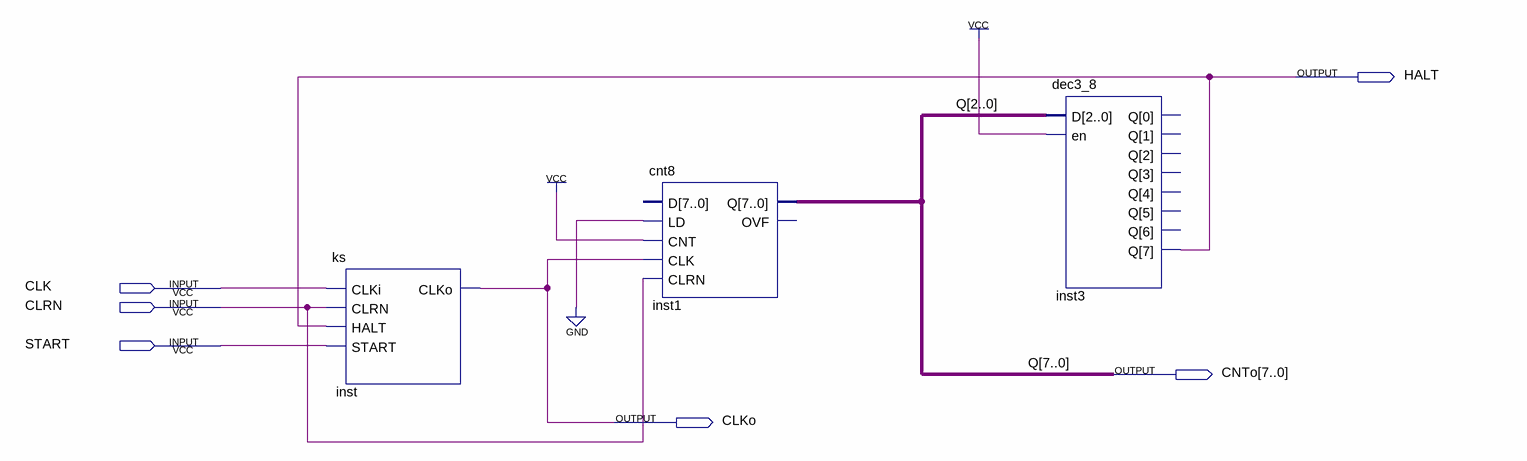
[diagram p0: schematic sheet]
// Quartus schematic ks_test.bdf as structural Verilog: 3 symbols, 6 pins
module ks_test (
  input  CLK,
  input  CLRN,
  input  START,
  output HALT,
  output [7:0] CNTo,
  output CLKo
);
  wire [7:0] inst3_q_open;  // unused outputs

  ks inst (.CLKi(CLK), .CLRN(CLRN), .HALT(HALT), .START(START), .CLKo(CLKo));
  cnt8 inst1 (.LD(1'b0), .CNT(1'b1), .CLK(CLKo), .CLRN(CLRN), .Q(CNTo));  // open: D, OVF
  dec3_8 inst3 (.D(CNTo[2:0]), .en(1'b1), .Q({HALT, inst3_q_open[6:0]}));

  // Other names for the same wires on the sheet: Q[7:0] = CNTo
endmodule
